# EAGLE design snes-usb-mini.b (EAGLE 6.1)
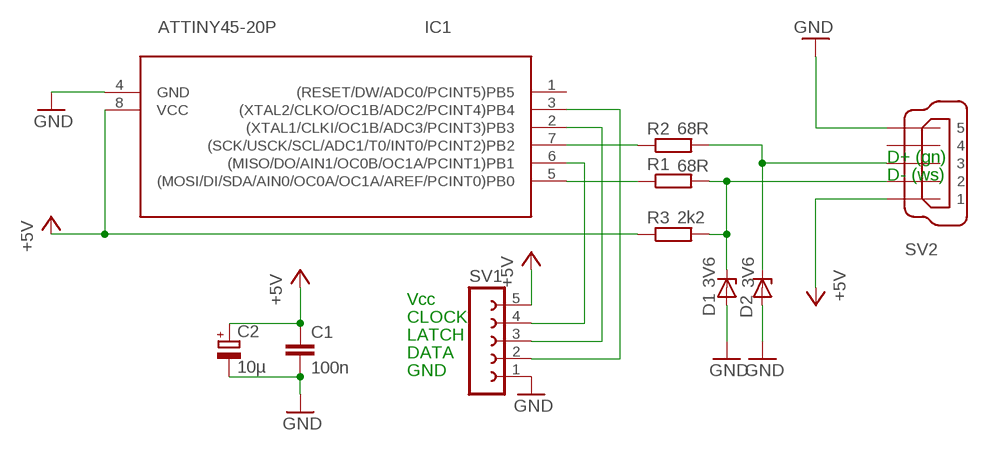
[diagram p0: schematic, sheet 1]

## Parts
C1  100n  C-EU025-024X044  [C025-024X044]
C2  10µ  CPOL-EUE2-4  [E2-4]
D1  3V6  ZENER-DIODEZD-2.5  [ZDIO-2.5]
D2  3V6  ZENER-DIODEZD-2.5  [ZDIO-2.5]
IC1  ATTINY45-20P  [DIL08]
R1  68R  R-EU_0207/10  [0207/10]
R2  68R  R-EU_0411/3V  [0411V]
R3  2k2  R-EU_0204/2V  [0204V]
SV1  FE05-1  [FE05-1]
SV2  MINI-USB_SHIELD5P2-32005-601  [32005-601]

## Nets
+5V: C1.1 C2.+ IC1.8(VCC) R3.1 SV1.5 SV2.1
GND: C1.2 C2.- D1.A D2.A IC1.4(GND) SV1.1 SV2.5
N$1: IC1.5((MOSI/DI/SDA/AIN0/OC0A/OC1A/AREF/PCINT0)PB0) R1.1
N$2: IC1.7((SCK/USCK/SCL/ADC1/T0/INT0/PCINT2)PB2) R2.1
N$3: D1.C R1.2 R3.2 SV2.2
N$4: D2.C R2.2 SV2.3
N$5: IC1.6((MISO/DO/AIN1/OC0B/OC1A/PCINT1)PB1) SV1.4
N$6: IC1.2((XTAL1/CLKI/OC1B/ADC3/PCINT3)PB3) SV1.3
N$7: IC1.3((XTAL2/CLKO/OC1B/ADC2/PCINT4)PB4) SV1.2
Unconnected: IC1.1((RESET/DW/ADC0/PCINT5)PB5) SV2.4 SV2.M1(S1) SV2.M2(S2)

## Notes on the sheet
- D+ (gn)
- D- (ws)
- Vcc
- CLOCK
- LATCH
- DATA
- GND

## Library data of the parts
C1 = rcl:C-EU: CAPACITOR, European symbol
C2 = rcl:CPOL-EU: POLARIZED CAPACITOR, European symbol
D1 D2 = diode:ZENER-DIODE: Z-Diode
IC1 = avr:ATTINY45: MICROCONTROLLER 4 Kbytes FLASH 256 bytes EEPROM 256 bytes RAM 4-channel 10 bit ADC USI
R1-R3 = rcl:R-EU_: RESISTOR, European symbol
SV1 = con-lsta:FE05-1: FEMALE HEADER
SV2 = con-cypressindustries:MINI-USB_SHIELD5P2-: MINI USB-B R/A DIP 5pol. Source: www.cypressindustries.com; OC_FARNELL: unknown; OC_NEWARK: unknown

## Board
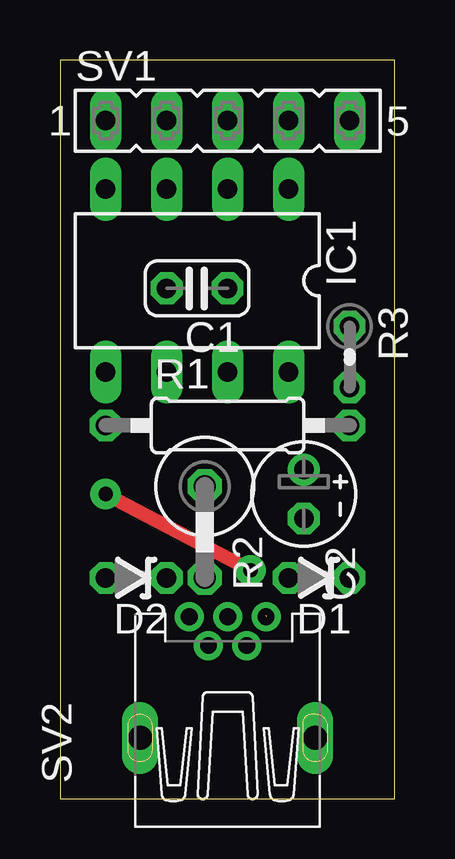
[diagram p1: board, top side]
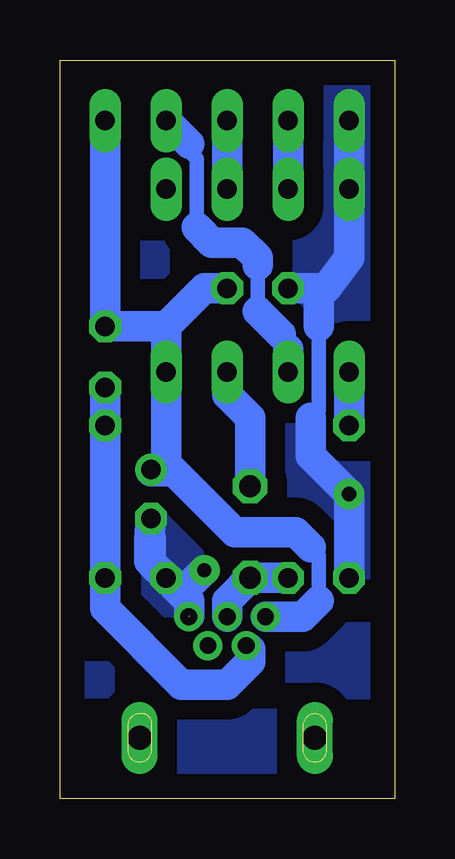
[diagram p2: board, bottom side, seen from below]

Size 13.95 x 30.79 mm. Coordinates in mm from the lower left corner, seen from the top.
Outline: 0,0 13.95,0 13.95,30.79 0,30.79 0,0
Copper layers (1*16): Top 0.035mm / dielectric 1.5mm / Bottom 0.035mm
Design rules: minimum track width 10mil, minimum drill 24mil, track to track 8mil, track to pad 8mil, pad to pad 8mil, via to via 8mil, smd to smd 8mil, copper to edge 40mil, drill to drill 8mil, minimum pad ring 10mil, minimum via ring 8mil, stop-mask expansion 4mil, vias tented up to drill 0mil, thermal gap 10mil

### Footprints (pad centres in the part's own frame; a part is rotated, then mirrored left to right if it is on the bottom)
C025-024X044 = drill 0.813 octagon: 1 -1.27,0; 2 1.27,0
E2-4 = drill 0.813 pad 1.27: + -1.016,0 | drill 0.813 pad 1.27 octagon: - 1.016,0
ZDIO-2.5 = drill 0.813 octagon: A 1.27,0; C -1.27,0
DIL08 = drill 0.813 long: 1 -3.81,-3.81; 2 -1.27,-3.81; 3 1.27,-3.81; 4 3.81,-3.81; 5 3.81,3.81; 6 1.27,3.81; 7 -1.27,3.81; 8 -3.81,3.81
0207/10 = drill 0.813 octagon: 1 -5.08,0; 2 5.08,0
0411V = drill 0.914 octagon: 1 -2.54,0; 2 1.27,0
0204V = drill 0.813 octagon: 1 -1.27,0; 2 1.27,0
FE05-1 = drill 0.813 long: 1 -5.08,0; 2 -2.54,0; 3 0,0; 4 2.54,0; 5 5.08,0
32005-601 = drill 0.7 pad 1.016: 1 2.825,1.6; 2 1.625,0.8; 3 2.825,0; 4 1.625,-0.8; 5 2.825,-1.6 | drill 1 pad 1.422 long: M1 -2.225,3.65; M2 -2.225,-3.65

### Placement (x,y rotation side)
C1  5.72,21.27 180 top
C2  10.16,12.7 270 top
D1  10.79,9.21 180 top
D2  3.18,9.21 180 top
IC1  5.72,21.59 180 top
R1  6.99,15.56 0 top
R2  6.03,10.48 270 top
R3  12.06,18.41 270 top
SV1  6.99,28.26 0 top
SV2  6.99,4.76 90 top

### Tracks (layer width: path | path; a pad name or v marks a point on that pad's centre or on a via)
+5V
  Bottom 0.61: 3.18,8.25 3.18,10.16 3.49,10.48
  Bottom 1.27: SV2.1 3.84,7.59 3.18,8.25 | SV1.5 R3.1 9.53,19.68 | C1.1 7.94,21.27 9.53,19.68 | 9.53,19.68 IC1.8 9.49,17.75 9.53,17.72 9.53,13.65 | 3.49,10.48 4.13,11.11 6.67,11.11 9.21,13.65 9.53,13.65 | 10.1,13.65 10.16,13.65 | C2.+ 10.1,13.65 | 10.1,13.65 9.53,13.65
GND  (via drill 0.6 pad 1.27)  (1 unrouted)
  Top 0.61: v7.94,9.52 v1.91,12.7
  Bottom 0.61: 3.18,19.68 3.18,16.19 3.49,15.88
  Bottom 1.27: SV1.1 IC1.4 1.91,22.54 2.86,21.27 3.18,21.27 | C1.2 3.18,21.27 | 3.18,21.27 3.18,19.68 | 10.16,9.84 10.22,9.91 10.24,10.79 | 10.24,10.79 C2.- | 10.24,10.79 10.16,10.86 10.16,9.84 | 10.16,9.84 D1.A 8.89,8.57 | 8.57,7.62 8.57,8.25 8.89,8.57 | v7.94,9.52 8.89,8.57 | 3.49,15.88 3.49,14.29 v1.91,12.7 D2.A
  pour Bottom (isolate 0.813, no thermals): 0,31.75 13.97,31.75 13.97,0 0,0
N$1
  Bottom 1.27: R1.1 IC1.5
N$2
  Bottom 1.27: R2.1 6.03,15.88 6.99,16.83 IC1.7
N$3
  Bottom 1.016: SV2.2 6.03,6.24
  Bottom 1.27: 6.03,6.24 6.03,5.72 6.99,4.76 8.89,4.76 12.06,7.94 D1.C R1.2 R3.2
N$4
  Bottom 1.27: D2.C R2.2 | R2.2 6.35,8.89 | SV2.3 6.99,8.25 R2.2
N$5
  Bottom 0.61: 8.57,27.3 8.57,26.99 8.26,26.67 8.26,23.81 | 4.45,18.73 4.45,19.05 4.76,19.37 | 5.72,20.32 5.72,22.22
  Bottom 1.27: SV1.4 8.57,27.3 | IC1.6 4.45,18.73 | 4.76,19.37 5.72,20.32 | 5.72,22.22 5.72,22.54 6.35,23.18 7.62,23.18 8.26,23.81
N$6
  Bottom 1.27: SV1.3 IC1.2
N$7
  Bottom 1.27: SV1.2 IC1.3